# Altium schematic sheet StepperInterface.SchDoc
size A
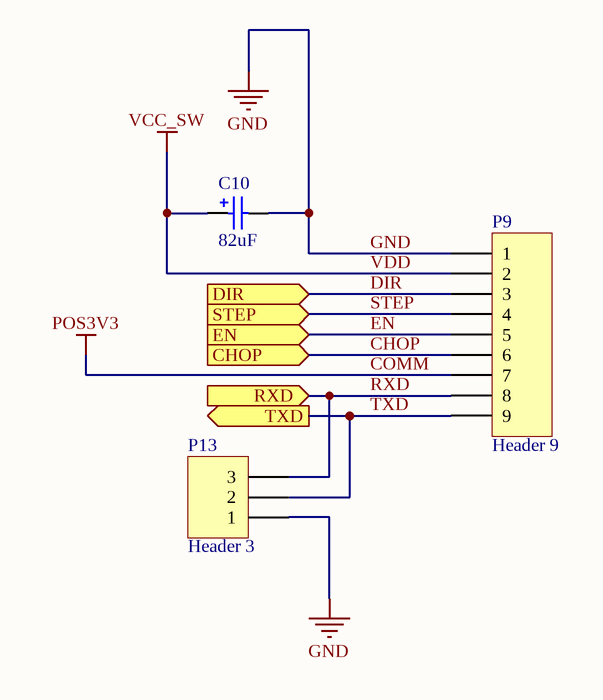
[diagram p0: StepperInterface.SchDoc]

## Parts
C10  value 82uF  [CAP_EEFK_D8]  (hidden comment: EEEFK1V680XP)
P9  Header 9  [HDR1X9]
P13  Header 3  [HDR1X3]

## Ports
CHOP (in), DIR (in), EN (in), RXD (in), STEP (in), TXD (out)

## Nets
COMM: P9.7  [also labelled POS3V3]
GND: C10.2 P9.1 P13.1
VDD: C10.1 P9.2  [also labelled VCC_SW]
CHOP: P9.6 ; port CHOP
DIR: P9.3 ; port DIR
EN: P9.5 ; port EN
RXD: P9.8 P13.3 ; port RXD
STEP: P9.4 ; port STEP
TXD: P9.9 P13.2 ; port TXD

## Library data of the parts
C10 = EEEFK1V680XP: Polarized Capacitor (Surface Mount); Vendor: Panasonic; Built_By: EMA_UL_Team; C: Copyright (C) 2015 Accelerated Designs. All rights reserved; Manufacturer_Part_Number: EEEFK1V680XP; Supplier 1: Digi-Key; Supplier Part Number 1: P18960DKR-ND
P9 = Header 9: Header, 9-Pin; LatestRevisionDate: 17-Jul-2002; LatestRevisionNote: Re-released for DXP Platform.; Publisher: Altium Limited
P13 = Header 3: Header, 3-Pin; LatestRevisionDate: 17-Jul-2002; LatestRevisionNote: Re-released for DXP Platform.; Publisher: Altium Limited